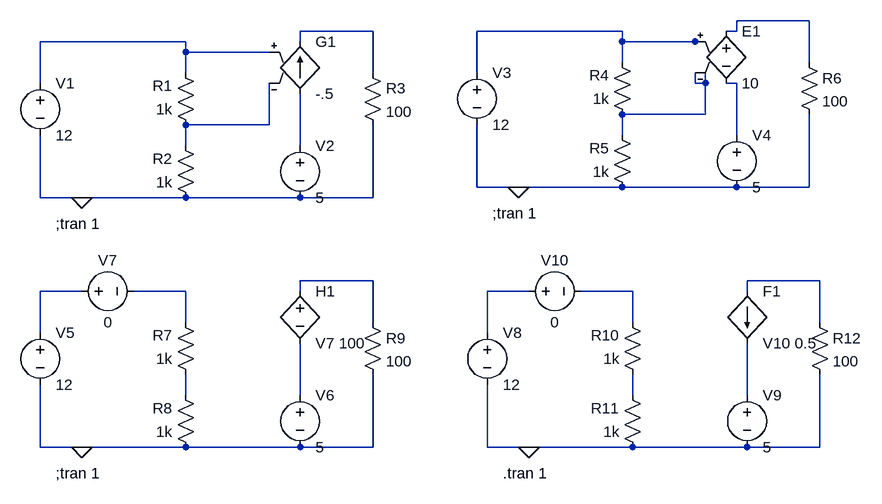
[diagram p0: schematic EXPT 2.asc]
EXPT 2.asc, the LTspice schematic file:
Version 4
SHEET 1 1124 712
WIRE 1040 0 928 0
WIRE 368 16 256 16
WIRE 752 16 528 16
WIRE 928 16 928 0
WIRE 928 16 912 16
WIRE 80 32 -144 32
WIRE 256 32 256 16
WIRE 752 32 752 16
WIRE 864 32 752 32
WIRE 880 32 864 32
WIRE 80 48 80 32
WIRE 208 48 80 48
WIRE 752 64 752 32
WIRE 1040 64 1040 0
WIRE 80 80 80 48
WIRE 368 80 368 16
WIRE 528 80 528 16
WIRE -144 96 -144 32
WIRE 864 96 864 80
WIRE 880 96 880 80
WIRE 880 96 864 96
WIRE 928 96 912 96
WIRE 880 144 880 96
WIRE 880 144 752 144
WIRE 208 160 208 96
WIRE 208 160 80 160
WIRE 752 176 752 144
WIRE 928 176 928 96
WIRE 80 192 80 160
WIRE 256 192 256 112
WIRE 528 256 528 160
WIRE 592 256 528 256
WIRE 752 256 592 256
WIRE 928 256 752 256
WIRE 1040 256 1040 144
WIRE 1040 256 928 256
WIRE -144 272 -144 176
WIRE -80 272 -144 272
WIRE 80 272 -80 272
WIRE 256 272 80 272
WIRE 368 272 368 160
WIRE 368 272 256 272
WIRE 368 400 256 400
WIRE 1056 400 944 400
WIRE -80 416 -144 416
WIRE 80 416 0 416
WIRE 256 416 256 400
WIRE 608 416 544 416
WIRE 768 416 688 416
WIRE 944 416 944 400
WIRE 80 464 80 416
WIRE 368 464 368 400
WIRE 768 464 768 416
WIRE 1056 464 1056 400
WIRE -144 480 -144 416
WIRE 544 480 544 416
WIRE 80 576 80 544
WIRE 256 576 256 496
WIRE 768 576 768 544
WIRE 944 576 944 496
WIRE -144 656 -144 560
WIRE -80 656 -144 656
WIRE 80 656 -80 656
WIRE 256 656 80 656
WIRE 368 656 368 544
WIRE 368 656 256 656
WIRE 544 656 544 560
WIRE 608 656 544 656
WIRE 768 656 608 656
WIRE 944 656 768 656
WIRE 1056 656 1056 544
WIRE 1056 656 944 656
FLAG -80 272 0
FLAG 592 256 0
FLAG -80 656 0
FLAG 608 656 0
SYMBOL voltage -144 80 R0
WINDOW 123 0 0 Left 0
WINDOW 39 0 0 Left 0
SYMATTR InstName V1
SYMATTR Value 12
SYMBOL res 96 176 R180
WINDOW 0 36 76 Left 2
WINDOW 3 36 40 Left 2
SYMATTR InstName R1
SYMATTR Value 1k
SYMBOL res 96 288 R180
WINDOW 0 36 76 Left 2
WINDOW 3 36 40 Left 2
SYMATTR InstName R2
SYMATTR Value 1k
SYMBOL res 352 64 R0
SYMATTR InstName R3
SYMATTR Value 100
SYMBOL voltage 256 176 R0
SYMATTR InstName V2
SYMATTR Value 5
SYMBOL g 256 16 R0
SYMATTR InstName G1
SYMATTR Value -.5
SYMBOL voltage 528 64 R0
WINDOW 123 0 0 Left 0
WINDOW 39 0 0 Left 0
SYMATTR InstName V3
SYMATTR Value 12
SYMBOL res 768 160 R180
WINDOW 0 36 76 Left 2
WINDOW 3 36 40 Left 2
SYMATTR InstName R4
SYMATTR Value 1k
SYMBOL res 768 272 R180
WINDOW 0 36 76 Left 2
WINDOW 3 36 40 Left 2
SYMATTR InstName R5
SYMATTR Value 1k
SYMBOL res 1024 48 R0
SYMATTR InstName R6
SYMATTR Value 100
SYMBOL voltage 928 160 R0
SYMATTR InstName V4
SYMATTR Value 5
SYMBOL e 912 0 R0
SYMATTR InstName E1
SYMATTR Value 10
SYMBOL voltage -144 464 R0
WINDOW 123 0 0 Left 0
WINDOW 39 0 0 Left 0
SYMATTR InstName V5
SYMATTR Value 12
SYMBOL res 96 560 R180
WINDOW 0 36 76 Left 2
WINDOW 3 36 40 Left 2
SYMATTR InstName R7
SYMATTR Value 1k
SYMBOL res 96 672 R180
WINDOW 0 36 76 Left 2
WINDOW 3 36 40 Left 2
SYMATTR InstName R8
SYMATTR Value 1k
SYMBOL res 352 448 R0
SYMATTR InstName R9
SYMATTR Value 100
SYMBOL voltage 256 560 R0
SYMATTR InstName V6
SYMATTR Value 5
SYMBOL voltage -96 416 R270
WINDOW 0 32 56 VTop 2
WINDOW 3 -32 56 VBottom 2
SYMATTR InstName V7
SYMATTR Value 0
SYMBOL h 256 400 R0
SYMATTR InstName H1
SYMATTR Value V7 100
SYMBOL voltage 544 464 R0
WINDOW 123 0 0 Left 0
WINDOW 39 0 0 Left 0
SYMATTR InstName V8
SYMATTR Value 12
SYMBOL res 784 560 R180
WINDOW 0 36 76 Left 2
WINDOW 3 36 40 Left 2
SYMATTR InstName R10
SYMATTR Value 1k
SYMBOL res 784 672 R180
WINDOW 0 36 76 Left 2
WINDOW 3 36 40 Left 2
SYMATTR InstName R11
SYMATTR Value 1k
SYMBOL res 1040 448 R0
SYMATTR InstName R12
SYMATTR Value 100
SYMBOL voltage 944 560 R0
SYMATTR InstName V9
SYMATTR Value 5
SYMBOL voltage 592 416 R270
WINDOW 0 32 56 VTop 2
WINDOW 3 -32 56 VBottom 2
SYMATTR InstName V10
SYMATTR Value 0
SYMBOL f 944 416 R0
SYMATTR InstName F1
SYMATTR Value V10 0.5
TEXT -120 312 Left 2 !;tran 1
TEXT 552 296 Left 2 !;tran 1
TEXT -120 696 Left 2 !;tran 1
TEXT 568 696 Left 2 !.tran 1

The netlist it stands for:
* EXPT 2.asc
V1 N004 0 12
R1 N007 N004 1k
R2 0 N007 1k
R3 N002 0 100
V2 N008 0 5
G1 N008 N002 N004 N007 -.5
V3 N003 0 12
R4 N005 N003 1k
R5 0 N005 1k
R6 N001 0 100
V4 N006 0 5
E1 N001 N006 N003 N005 10
V5 N011 0 12
R7 N015 N012 1k
R8 0 N015 1k
R9 N009 0 100
V6 N016 0 5
V7 N011 N012 0
H1 N009 N016 V7 100
V8 N013 0 12
R10 N017 N014 1k
R11 0 N017 1k
R12 N010 0 100
V9 N018 0 5
V10 N013 N014 0
F1 N010 N018 V10 0.5
;tran 1
;tran 1
;tran 1
.tran 1
.backanno
.end